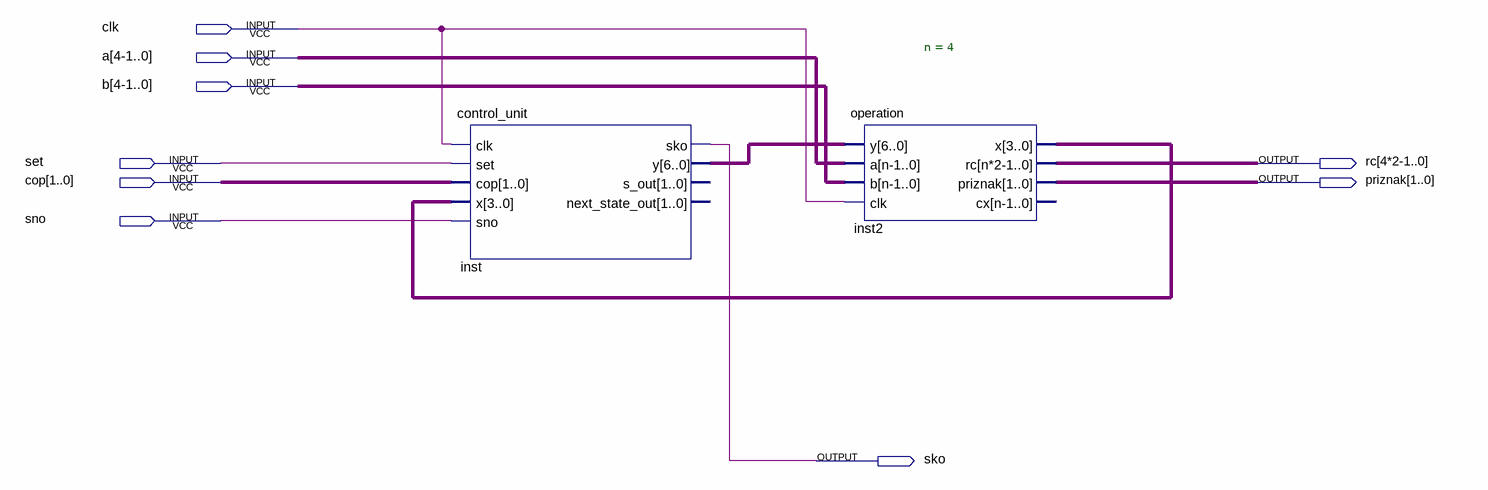
[diagram p0: schematic sheet]
// Quartus schematic alu.bdf as structural Verilog: 2 symbols, 9 pins
module alu (
  input  clk,
  input  \a[4-1..0] ,
  input  \b[4-1..0] ,
  input  set,
  input  [1:0] cop,
  input  sno,
  output \rc[4*2-1..0] ,
  output [1:0] priznak,
  output sko
);

  wire [3:0] inst2_x, undriven, undriven_2;
  wire [6:0] inst_y;
  wire [7:0] inst2_rc;

  control_unit inst (
    .clk(clk), .set(set), .cop(cop), .x(inst2_x), .sno(sno), .sko(sko), .y(inst_y));  // open: s_out, next_state_out
  operation #(.n(4)) inst2 (
    .y(inst_y), .a(undriven), .b(undriven_2), .clk(clk), .x(inst2_x), .rc(inst2_rc), .priznak(priznak));  // open: cx
endmodule
